# EAGLE design FlyballETS-MBD (EAGLE 7.5.0)
CNAME: Alex Goris
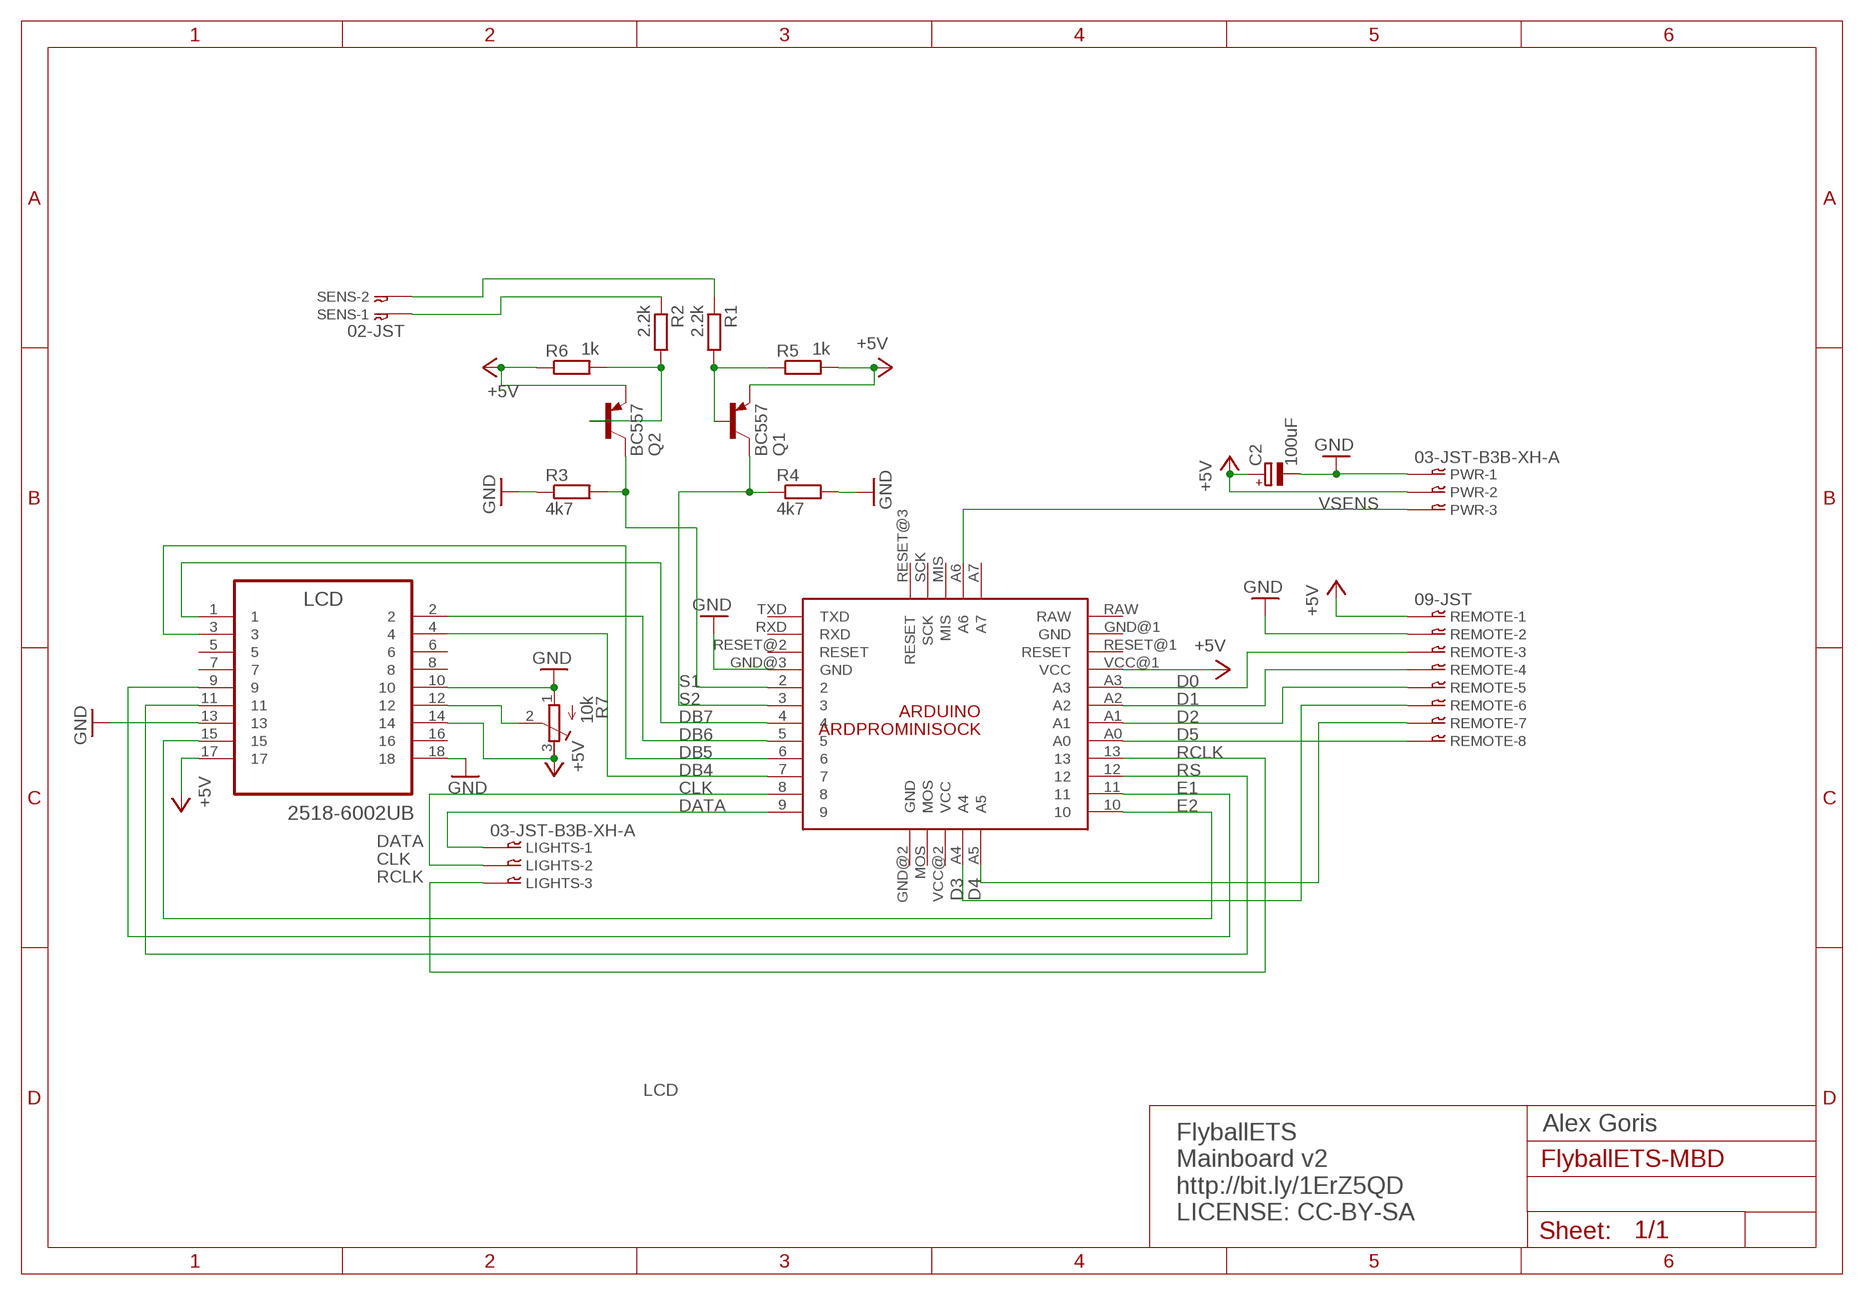
[diagram p0: schematic, sheet 1]

## Parts
ARDUINO  ARDPROMINISOCK  [ARDPROMINISOCK]
C2  100uF  CPOL-EUE2,5-6E  [E2,5-6E]
LCD  2518-6002UB  [3M_2518-6002UB]
LIGHTS  03-JST-B3B-XH-A  [B3B-XH]
PWR  03-JST-B3B-XH-A  [B3B-XH]
Q1  BC557  [TO92]
Q2  BC557  [TO92]
R1  2.2k  R-EU_0207/10  [0207/10]
R2  2.2k  R-EU_0207/10  [0207/10]
R3  4k7  R-EU_0207/10  [0207/10]
R4  4k7  R-EU_0207/10  [0207/10]
R5  1k  R-EU_0207/10  [0207/10]
R6  1k  R-EU_0207/10  [0207/10]
R7  10k  R-TRIMM3339P  [RTRIM3339P]
REMOTE  09-JST  [B9B-XH]
SENS  02-JST  [B2B-XH]

## Nets
+5V: ARDUINO.VCC@1(VCC) C2.+ LCD.14 LCD.17 PWR.P$2 Q1.1(E) Q2.1(E) R5.2 R6.1 R7.3(E) REMOTE.P$1
CLK: ARDUINO.8 LIGHTS.P$2
D0: ARDUINO.A3 REMOTE.P$3
D1: ARDUINO.A2 REMOTE.P$4
D2: ARDUINO.A1 REMOTE.P$5
D3: ARDUINO.A4 REMOTE.P$6
D4: ARDUINO.A5 REMOTE.P$7
D5: ARDUINO.A0 REMOTE.P$8
DATA: ARDUINO.9 LIGHTS.P$1
DB4: ARDUINO.7 LCD.4
DB5: ARDUINO.6 LCD.3
DB6: ARDUINO.5 LCD.2
DB7: ARDUINO.4 LCD.1
E1: ARDUINO.11 LCD.9
E2: ARDUINO.10 LCD.15
GND: ARDUINO.GND@3(GND) C2.- LCD.10 LCD.13 LCD.18 PWR.P$1 R3.1 R4.2 R7.1(A) REMOTE.P$2
N$1: R1.1 SENS.P$2
N$2: R2.1 SENS.P$1
N$3: Q1.2(B) R1.2 R5.1
N$4: Q2.2(B) R2.2 R6.2
N$5: LCD.12 R7.2(S)
RCLK: ARDUINO.13 LIGHTS.P$3
RS: ARDUINO.12 LCD.11
S1: ARDUINO.2 Q2.3(C) R3.2
S2: ARDUINO.3 Q1.3(C) R4.1
VSENS: ARDUINO.A6 PWR.P$3
Unconnected: ARDUINO.A7 ARDUINO.GND@1(GND) ARDUINO.GND@2(GND) ARDUINO.MIS ARDUINO.MOS ARDUINO.RAW ARDUINO.RESET@1(RESET) ARDUINO.RESET@2(RESET) ARDUINO.RESET@3(RESET) ARDUINO.RXD ARDUINO.SCK ARDUINO.TXD ARDUINO.VCC@2(VCC) LCD.5 LCD.6 LCD.7 LCD.8 LCD.16 REMOTE.P$9

## Notes on the sheet
- LCD
- Alex Goris
- FlyballETS
  Mainboard v2
  http://bit.ly/1ErZ5QD
  LICENSE: CC-BY-SA

## Library data of the parts
ARDUINO = _custom:ARDPROMINISOCK
C2 = resistor:CPOL-EU: POLARIZED CAPACITOR, European symbol
LCD = 3M_By_element14_Batch_1:2518-6002UB
LIGHTS PWR = bt_con-jst-xh:03-JST: JST CONNECTOR
Q1 Q2 = transistor-pnp:BC557: PNP Transistor
R1-R6 = resistor:R-EU_: RESISTOR, European symbol
R7 = resistor:R-TRIMM: Trimm resistor
REMOTE = bt_con-jst-xh:09-JST: JST CONNECTOR
SENS = bt_con-jst-xh:02-JST: JST CONNECTOR

## Board
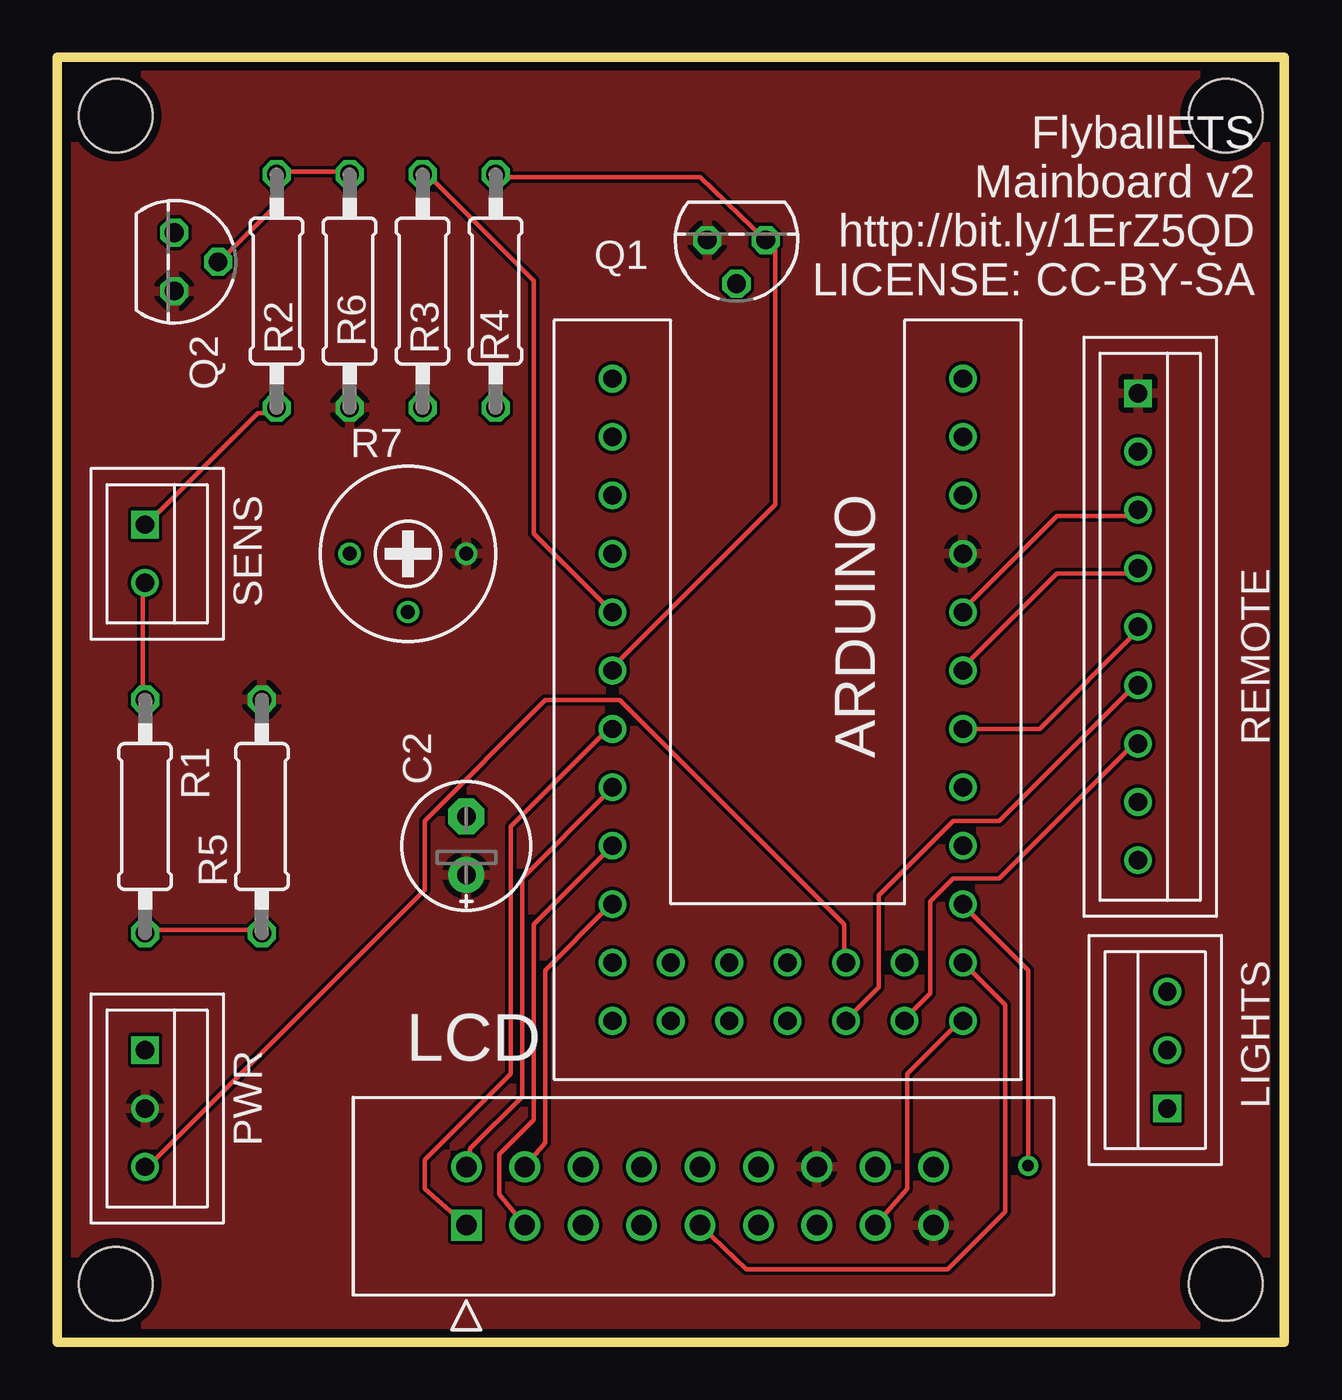
[diagram p1: board, top side]
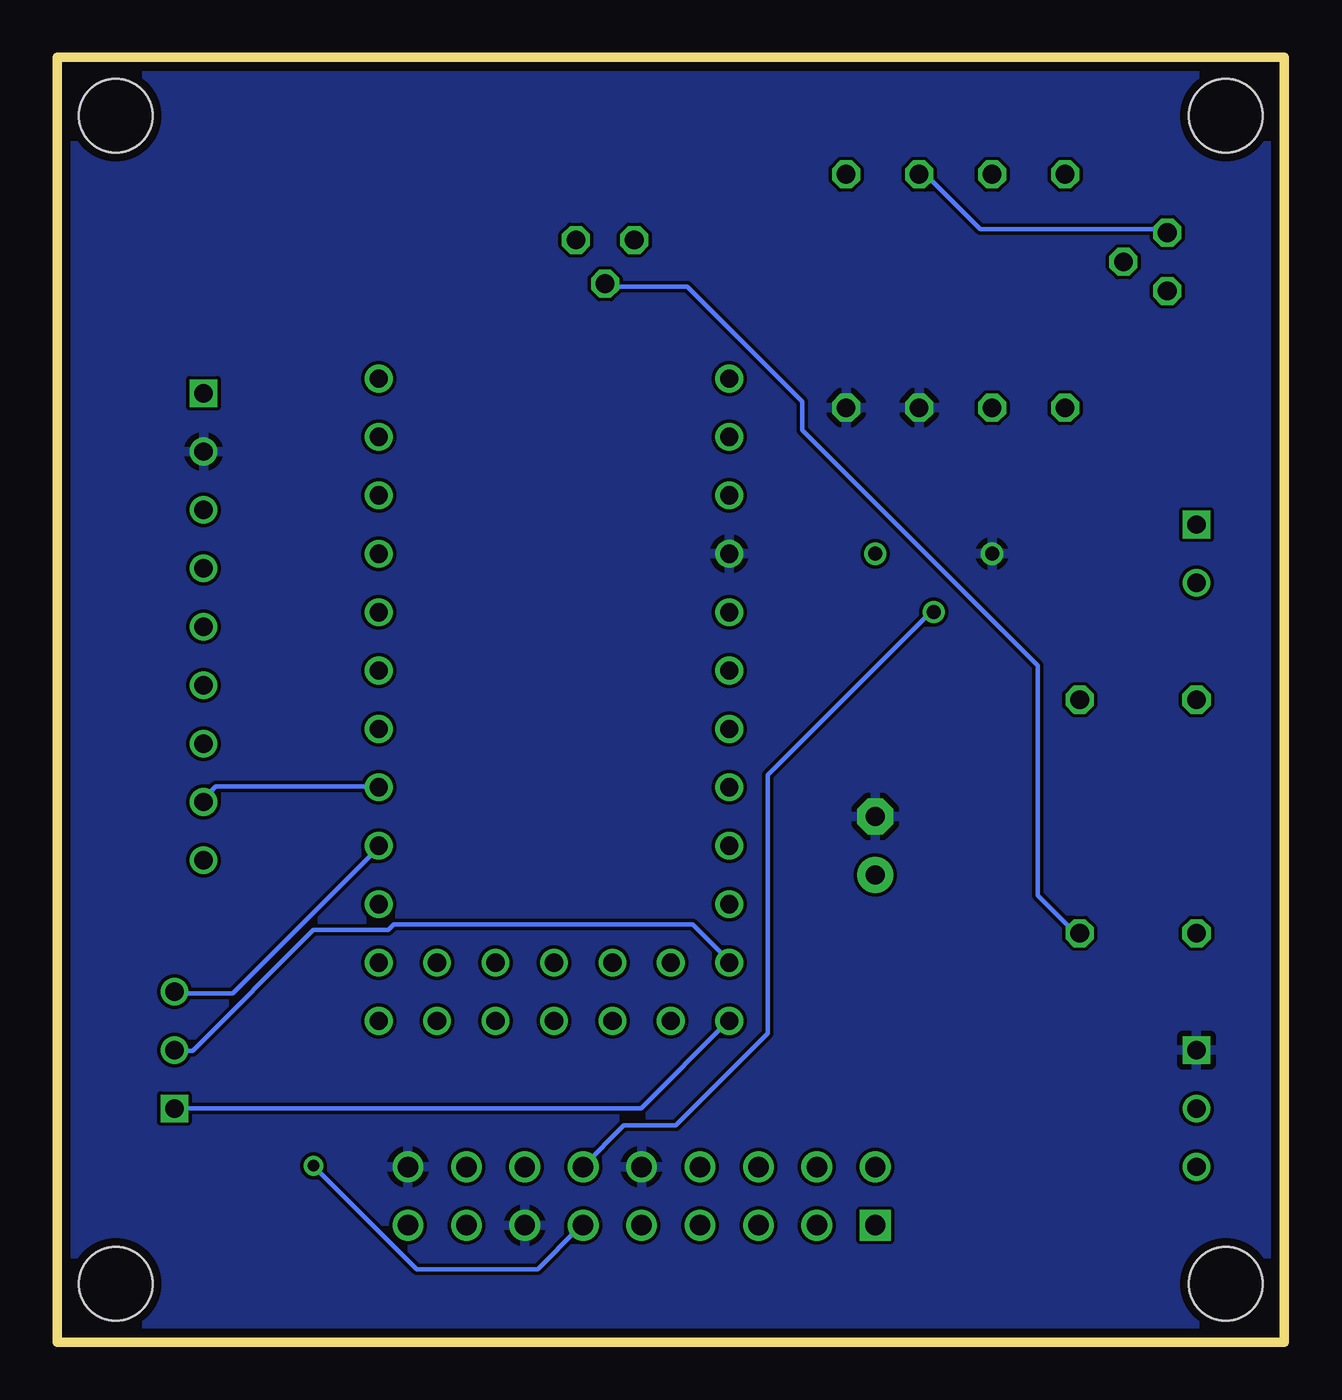
[diagram p2: board, bottom side, seen from below]

Size 53.34 x 55.88 mm. Coordinates in mm from the lower left corner, seen from the top.
Outline: 0,0 53.34,0 53.34,55.88 0,55.88 0,0
Copper layers (1*16): Top 0.0356mm / dielectric 1.5011mm / Bottom 0.0356mm
Design rules "LaenPCBOrder": minimum track width 6mil, minimum drill 13mil, track to track 6mil, track to pad 6mil, pad to pad 6mil, via to via 6mil, smd to smd 6mil, copper to edge 15mil, drill to drill 6mil, minimum pad ring 7mil, minimum via ring 7mil, stop-mask expansion 3mil, vias tented up to drill 0mil, thermal gap 10mil
Holes 3.2 mm at 2.54,2.54 50.8,2.54 50.8,53.34 2.54,53.34

### Footprints (pad centres in the part's own frame; a part is rotated, then mirrored left to right if it is on the bottom)
ARDPROMINISOCK = drill 0.8: 2 17.78,12.7; 3 17.78,15.24; 4 17.78,17.78; 5 17.78,20.32; 6 17.78,22.86; 7 17.78,25.4; 8 17.78,27.94; 9 17.78,30.48; 10 2.54,30.48; 11 2.54,27.94; 12 2.54,25.4; 13 2.54,22.86; A0 2.54,20.32; A1 2.54,17.78; A2 2.54,15.24; A3 2.54,12.7; A4 7.62,30.48; A5 5.08,30.48; A6 7.62,27.94; A7 5.08,27.94; GND@1 2.54,5.08; GND@2 15.24,30.48; GND@3 17.78,10.16; MIS 10.16,27.94; MOS 12.7,30.48; RAW 2.54,2.54; RESET@1 2.54,7.62; RESET@2 15.24,27.94; RESET@3 17.78,7.62; RXD 17.78,5.08; SCK 12.7,27.94; TXD 17.78,2.54; VCC@1 2.54,10.16; VCC@2 10.16,30.48
E2,5-6E = drill 0.813 pad 1.575: + -1.27,0 | drill 0.813 pad 1.575 octagon: - 1.27,0
3M_2518-6002UB = drill 0.889 square: 1 0,2.54 | drill 0.889: 2 0,0; 3 -2.54,2.54; 4 -2.54,0; 5 -5.08,2.54; 6 -5.08,0; 7 -7.62,2.54; 8 -7.62,0; 9 -10.16,2.54; 10 -10.16,0; 11 -12.7,2.54; 12 -12.7,0; 13 -15.24,2.54; 14 -15.24,0; 15 -17.78,2.54; 16 -17.78,0; 17 -20.32,2.54; 18 -20.32,0
B3B-XH = drill 0.8 square: P$1 -2.54,0 | drill 0.8: P$2 0,0; P$3 2.54,0
TO92 = drill 0.813 octagon: 1 1.27,0; 2 0,1.905; 3 -1.27,0
0207/10 = drill 0.813 octagon: 1 -5.08,0; 2 5.08,0
RTRIM3339P = drill 0.61: 1 -2.54,0; 2 0,-2.54; 3 2.54,0
B9B-XH = drill 0.8 square: P$1 -8.89,0 | drill 0.8: P$2 -6.35,0; P$3 -3.81,0; P$4 -1.27,0; P$5 1.27,0; P$6 3.81,0; P$7 6.35,0; P$8 8.89,0; P$9 11.43,0
B2B-XH = drill 0.8 square: P$1 -2.54,0 | drill 0.8: P$2 0,0

### Placement (x,y rotation side)
ARDUINO  41.91,44.45 180 top
C2  17.78,21.59 90 top
LCD  17.78,7.62 180 top
LIGHTS  48.26,12.7 90 top
PWR  3.81,10.16 270 top
Q1  29.53,47.94 180 top
Q2  5.08,46.99 270 top
R1  3.81,22.86 270 top
R2  9.52,45.72 90 top
R3  15.88,45.72 90 top
R4  19.05,45.72 270 top
R5  8.89,22.86 90 top
R6  12.7,45.72 90 top
R7  15.24,34.29 0 top
REMOTE  46.99,32.39 270 top
SENS  3.81,33.02 270 top
U$1  [A5L-LOC]  -68.58,-43.18 0 top  (outside the outline)

### Tracks (layer width: path | path; a pad name or v marks a point on that pad's centre or on a via)
+5V
  pour Top: 0,0 53.34,0 53.34,55.88 0,55.88
CLK
  Bottom 0.203: ARDUINO.8 24.21,16.67 25.71,18.17 38.71,18.17 38.96,17.92 42.21,17.92 47.46,12.67 48.21,12.67 LIGHTS.P$2
D0
  Top 0.203: ARDUINO.A3 39.46,31.92 43.46,35.92 46.71,35.92 46.96,36.17 REMOTE.P$3
D1
  Top 0.203: ARDUINO.A2 39.46,29.42 43.46,33.42 46.96,33.42 REMOTE.P$4
D2
  Top 0.203: ARDUINO.A1 42.71,26.67 46.96,30.92 REMOTE.P$5
D3
  Top 0.203: ARDUINO.A4 34.46,14.17 35.71,15.42 35.71,19.42 38.96,22.67 40.96,22.67 46.96,28.67 REMOTE.P$6
D4
  Top 0.203: ARDUINO.A5 36.96,14.17 37.96,15.17 37.96,19.17 38.96,20.17 40.96,20.17 46.96,26.17 REMOTE.P$7
D5
  Bottom 0.203: ARDUINO.A0 39.46,24.17 46.46,24.17 46.96,23.67 REMOTE.P$8
DATA
  Bottom 0.203: ARDUINO.9 24.21,13.92 27.96,10.17 48.21,10.17 LIGHTS.P$1
DB4
  Top 0.203: ARDUINO.7 23.96,18.92 21.21,16.17 21.21,8.67 LCD.4
DB5
  Top 0.203: ARDUINO.6 20.71,18.17 20.71,9.67 19.21,8.17 19.21,6.42 LCD.3
DB6
  Top 0.203: ARDUINO.5 23.96,23.92 20.21,20.17 20.21,10.67 17.96,8.42 LCD.2
DB7
  Top 0.203: ARDUINO.4 23.96,26.67 19.71,22.42 19.71,11.67 15.96,7.92 15.96,6.67 LCD.1
E1
  Top 0.203: ARDUINO.11 41.21,14.67 41.21,5.67 38.71,3.17 29.96,3.17 LCD.9
E2
  Top 0.203: ARDUINO.10 39.21,13.92 36.96,11.67 36.96,6.67 LCD.15
GND
  pour Bottom: 0,0 53.34,0 53.34,55.88 0,55.88
N$1
  Top 0.203: SENS.P$2 3.71,32.92 3.71,28.17 R1.1
N$2
  Top 0.203: SENS.P$1 3.96,35.67 8.71,40.42 9.46,40.42 R2.1
N$3
  Top 0.203: R1.2 3.96,17.92 8.71,17.92 R5.1
  Bottom 0.203: Q1.2 29.46,45.92 25.96,45.92 20.96,40.92 20.96,39.67 10.71,29.42 10.71,19.42 8.96,17.67 R5.1
N$4
  Top 0.203: Q2.2 7.21,47.17 9.46,49.42 9.46,50.67 R2.2 9.71,50.92 12.46,50.92 R6.2
N$5
  Bottom 0.203: R7.2 15.46,31.67 22.46,24.67 22.46,13.42 26.46,9.42 28.71,9.42 30.46,7.67 LCD.12
RCLK
  Bottom 0.203: ARDUINO.13 39.46,21.42 45.71,15.17 48.21,15.17 LIGHTS.P$3
RS  (via drill 0.51)
  Top 0.203: v42.21,7.67 42.21,16.17 39.46,18.92 ARDUINO.12
  Bottom 0.203: v42.21,7.67 37.71,3.17 32.46,3.17 30.71,4.92 LCD.11
S1
  Top 0.203: ARDUINO.2 20.71,35.17 20.71,46.17 15.96,50.92 R3.2
  Bottom 0.203: Q2.3 5.21,48.42 13.21,48.42 15.71,50.92 R3.2
S2
  Top 0.203: ARDUINO.3 24.21,29.42 31.21,36.42 31.21,47.67 Q1.3 27.96,50.67 19.21,50.67 R4.1
VSENS
  Top 0.203: PWR.P$3 3.96,7.67 15.96,19.67 15.96,22.67 21.21,27.92 24.46,27.92 34.21,18.17 34.21,16.67 ARDUINO.A6

### Text on the board
tPlace: FlyballETS / Mainboard v2 / http://bit.ly/1ErZ5QD / LICENSE: CC-BY-SA | ARDUINO
Document: Alex Goris | FlyballETS / Mainboard v2 / http://bit.ly/1ErZ5QD / LICENSE: CC-BY-SA | Units: mm